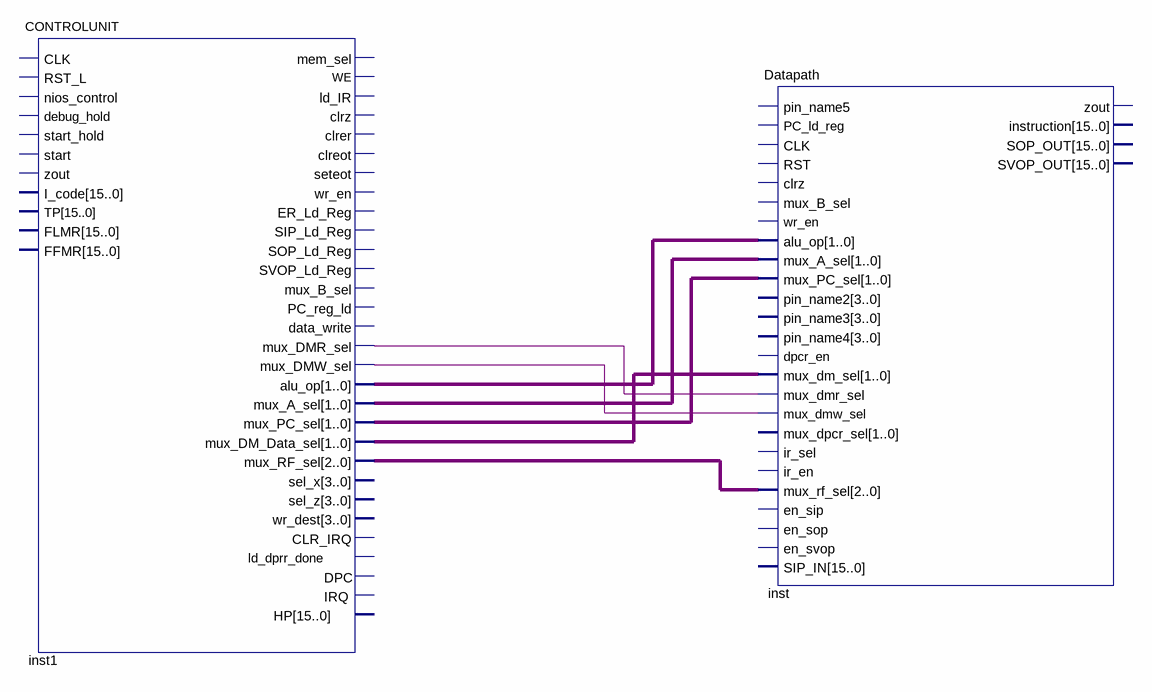
[diagram p0: schematic sheet]
// Quartus schematic Processor.bdf as structural Verilog: 2 symbols, 0 pins
module Processor (
);

  wire inst1_mux_dmr_sel, inst1_mux_dmw_sel;
  wire [1:0] inst1_alu_op, inst1_mux_a_sel, inst1_mux_dm_data_sel, inst1_mux_pc_sel;
  wire [2:0] inst1_mux_rf_sel;

  CONTROLUNIT inst1 (
    .mux_DMR_sel(inst1_mux_dmr_sel), .mux_DMW_sel(inst1_mux_dmw_sel), .alu_op(inst1_alu_op),
    .mux_A_sel(inst1_mux_a_sel), .mux_PC_sel(inst1_mux_pc_sel), .mux_DM_Data_sel(inst1_mux_dm_data_sel),
    .mux_RF_sel(inst1_mux_rf_sel));  // open: CLK, RST_L, nios_control, debug_hold, start_hold, start, zout, I_code, TP, FLMR, FFMR, mem_sel, WE, ld_IR, clrz, clrer, clreot, seteot, wr_en, ER_Ld_Reg, SIP_Ld_Reg, SOP_Ld_Reg, SVOP_Ld_Reg, mux_B_sel, PC_reg_ld, data_write, sel_x, sel_z, wr_dest, CLR_IRQ, ld_dprr_done, DPC, IRQ, HP
  Datapath inst (
    .alu_op(inst1_alu_op), .mux_A_sel(inst1_mux_a_sel), .mux_PC_sel(inst1_mux_pc_sel),
    .mux_dm_sel(inst1_mux_dm_data_sel), .mux_dmr_sel(inst1_mux_dmr_sel), .mux_dmw_sel(inst1_mux_dmw_sel),
    .mux_rf_sel(inst1_mux_rf_sel));  // open: pin_name5, PC_ld_reg, CLK, RST, clrz, mux_B_sel, wr_en, pin_name2, pin_name3, pin_name4, dpcr_en, mux_dpcr_sel, ir_sel, ir_en, en_sip, en_sop, en_svop, SIP_IN, zout, instruction, SOP_OUT, SVOP_OUT
endmodule
